# Altium project HMI_STM32_edited.PrjPcb (part 2 of 2)

## Sheet pripherals.SchDoc
size A3
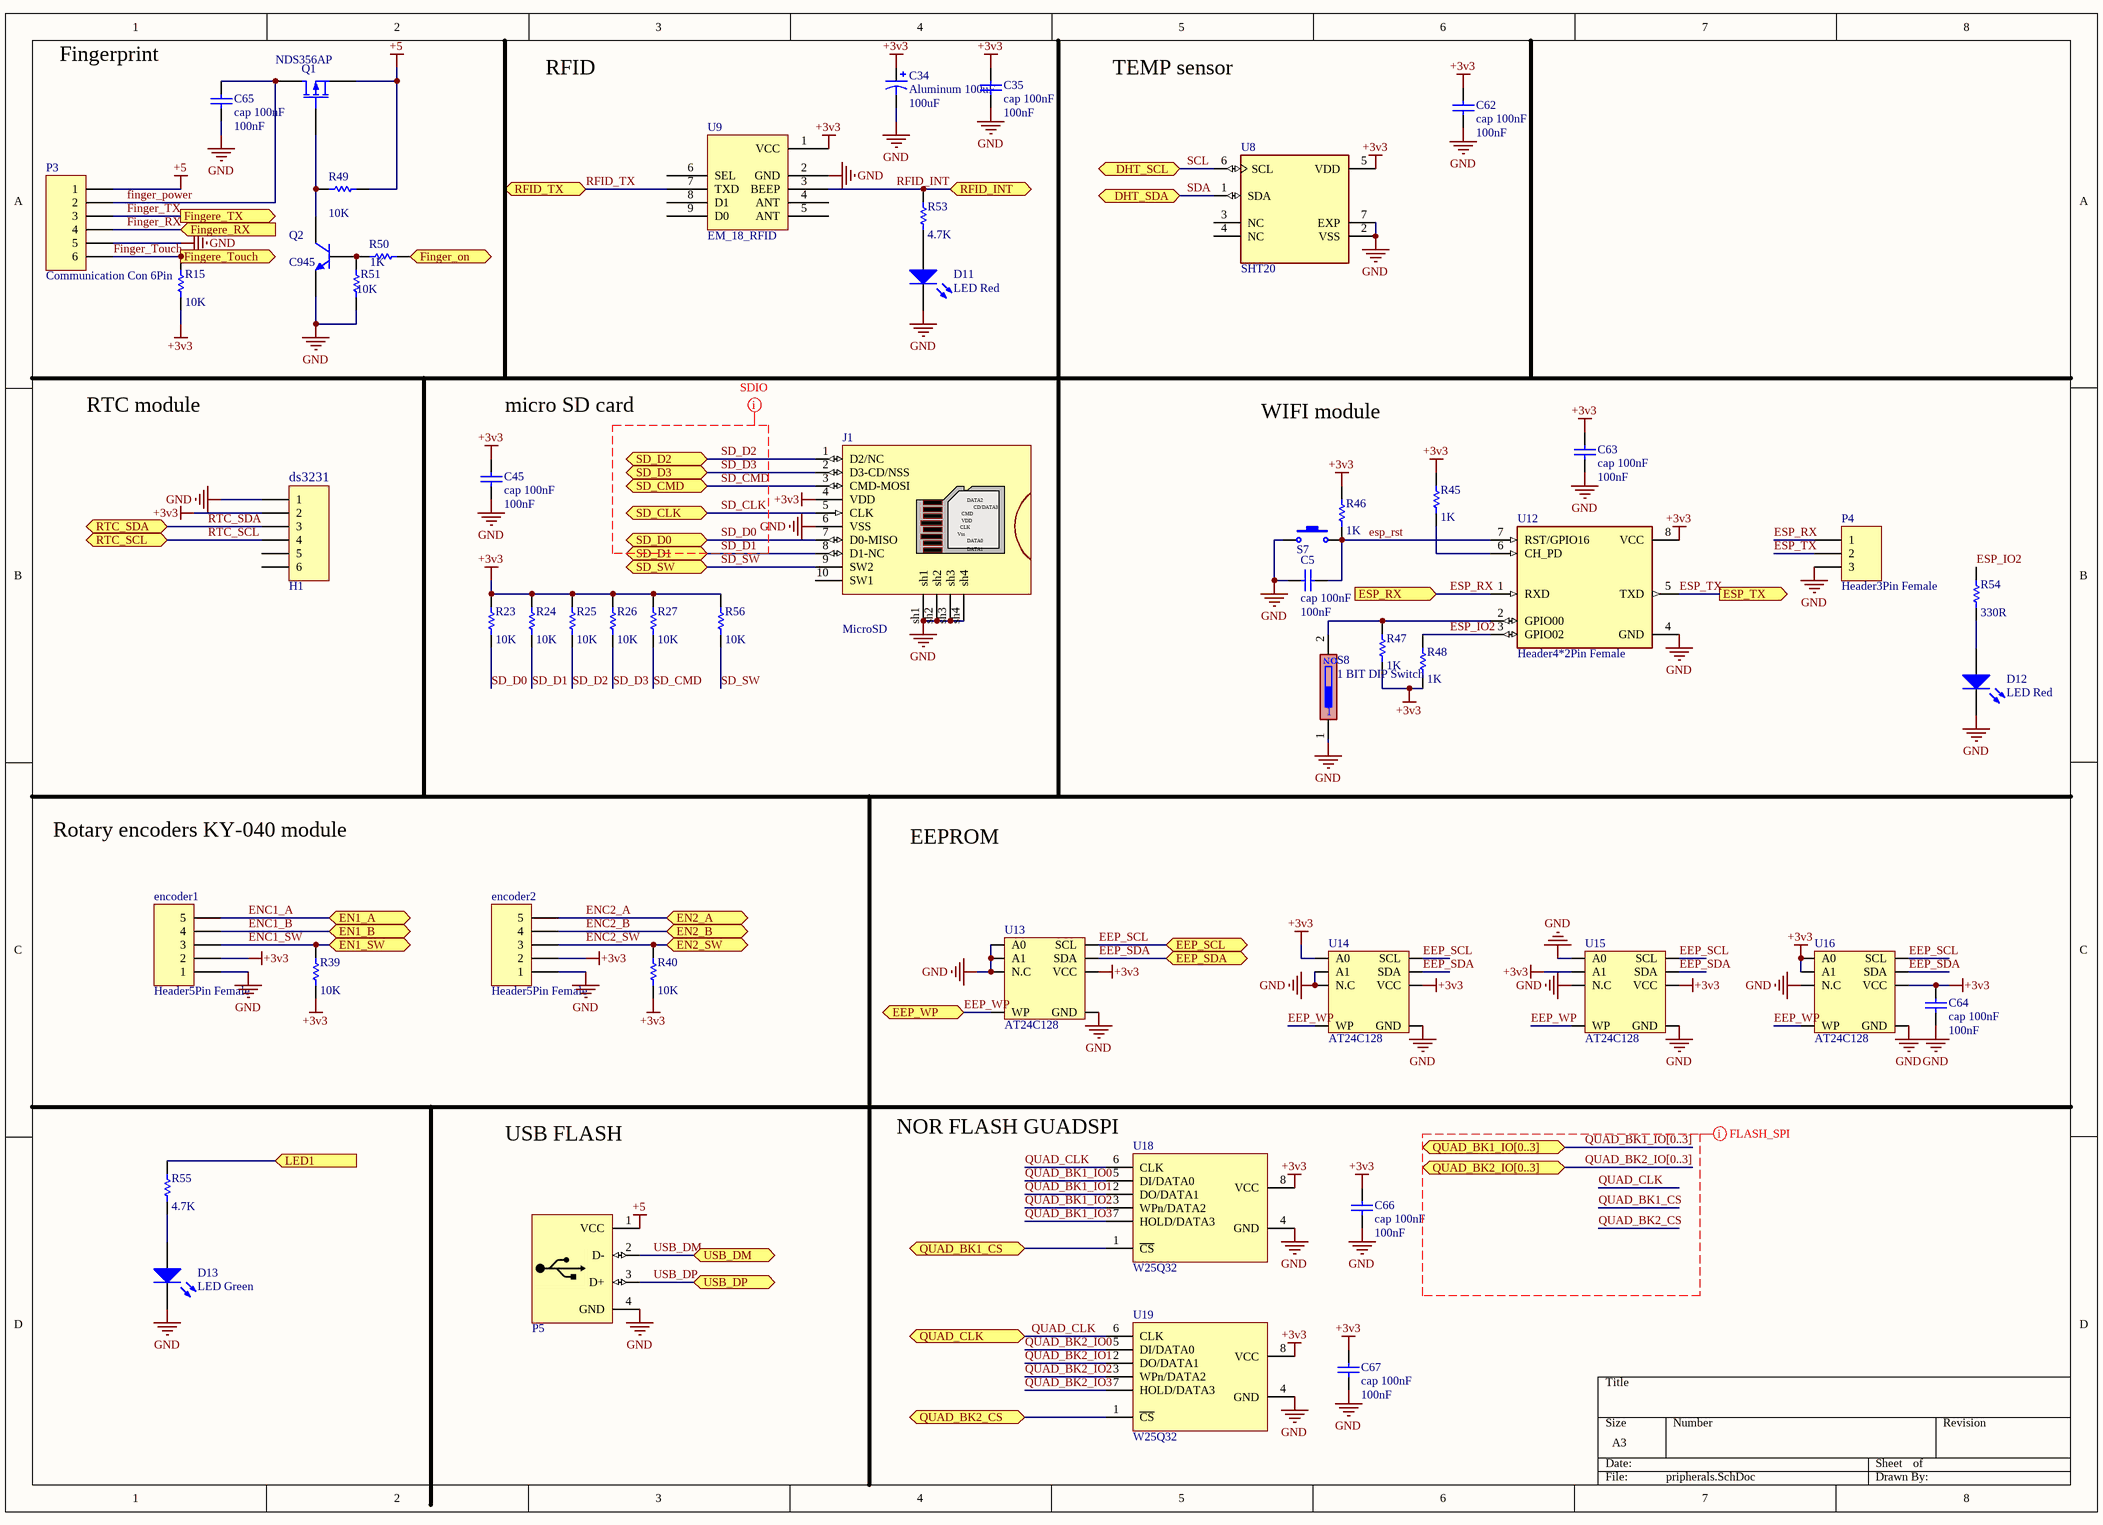
[diagram p6: pripherals.SchDoc]

### Parts
C5  cap 100nF  value 100nF  [Cap 805]
C34  Aluminum 100uF  value 100uF  [Cap SMD 100UF 35~50v]
C35  cap 100nF  value 100nF  [Cap 805]
C45  cap 100nF  value 100nF  [Cap 805]
C62  cap 100nF  value 100nF  [Cap 805]
C63  cap 100nF  value 100nF  [Cap 805]
C64  cap 100nF  value 100nF  [Cap 805]
C65  cap 100nF  value 100nF  [Cap 805]
C66  cap 100nF  value 100nF  [Cap 805]
C67  cap 100nF  value 100nF  [Cap 805]
D11  LED Red  [0805-LED]
D12  LED Red  [0805-LED]
D13  LED Green  [0805-LED]
encoder1  Header5Pin Female  [ky-040-encoder]
encoder2  Header5Pin Female  [ky-040-encoder]
H1  Header6Pin Female Right  [ds3231]  (value not drawn)
J1  MicroSD  [SD_card]
P3  Communication Con 6Pin  [HDR1X6]
P4  Header3Pin Female  [HDR1X3]
P5  USB Connector A Type Femal  [USB2.5-2H4C]  (value not drawn)
Q1  NDS356AP  [SOT23_N]
Q2  C945  [SOT23_N]
R15  value 10K  [RES 0805 (2012X06L)]  (hidden comment: Res 10K)
R23  value 10K  [RES 0805 (2012X06L)]  (hidden comment: Res 10K)
R24  value 10K  [RES 0805 (2012X06L)]  (hidden comment: Res 10K)
R25  value 10K  [RES 0805 (2012X06L)]  (hidden comment: Res 10K)
R26  value 10K  [RES 0805 (2012X06L)]  (hidden comment: Res 10K)
R27  value 10K  [RES 0805 (2012X06L)]  (hidden comment: Res 10K)
R39  value 10K  [RES 0805 (2012X06L)]  (hidden comment: Res 10K)
R40  value 10K  [RES 0805 (2012X06L)]  (hidden comment: Res 10K)
R45  value 1K  [RES 0805 (2012X06L)]  (hidden comment: Res 1K)
R46  value 1K  [RES 0805 (2012X06L)]  (hidden comment: Res 1K)
R47  value 1K  [RES 0805 (2012X06L)]  (hidden comment: Res 1K)
R48  value 1K  [RES 0805 (2012X06L)]  (hidden comment: Res 1K)
R49  value 10K  [RES 0805 (2012X06L)]  (hidden comment: Res 10K)
R50  value 1K  [RES 0805 (2012X06L)]  (hidden comment: Res 1K)
R51  value 10K  [RES 0805 (2012X06L)]  (hidden comment: Res 10K)
R53  value 4.7K  [RES 0805 (2012X06L)]  (hidden comment: Res 4.7K)
R54  value 330R  [RES 0805 (2012X06L)]  (hidden comment: Res 330R)
R55  value 4.7K  [RES 0805 (2012X06L)]  (hidden comment: Res 4.7K)
R56  value 10K  [RES 0805 (2012X06L)]  (hidden comment: Res 10K)
S7  Switch PB  [Switch - Push to On]  (value not drawn)
S8  1 BIT DIP Switch  [DIP Switch x1]
U8  SHT20  [XDCR_SHT20]
U9  EM_18_RFID  [EM-18]
U12  Header4*2Pin Female  [ESP8266-01/ESP-01]
U13  AT24C128  [SOIC-8]
U14  AT24C128  [SOIC-8]
U15  AT24C128  [SOIC-8]
U16  AT24C128  [SOIC-8]
U18  W25Q32  [WSON-8x6]
U19  W25Q32  [WSON-8x6]

### Ports
DHT_SCL (bidir), DHT_SDA (bidir), EEP_SCL (bidir), EEP_SDA (bidir), EEP_WP (bidir), EN1_A (bidir), EN1_B (bidir), EN1_SW (bidir), EN2_A (bidir), EN2_B (bidir), EN2_SW (bidir), ESP_RX (in), ESP_TX (out), Finger_on (bidir), Fingere_RX (in), Fingere_Touch (out), Fingere_TX (out), LED1 (in), QUAD_BK1_CS (bidir), QUAD_BK1_IO[0..3] (bidir), QUAD_BK2_CS (bidir), QUAD_BK2_IO[0..3] (bidir), QUAD_CLK (bidir), RFID_INT (bidir), RFID_TX (bidir), RTC_SCL (bidir), RTC_SDA (bidir), SD_CLK (bidir), SD_CMD (bidir), SD_D0 (bidir), SD_D1 (bidir), SD_D2 (bidir), SD_D3 (bidir), SD_SW (bidir), USB_DM (bidir), USB_DP (bidir)

### Nets
+3v3: C34.1 C35.2 C45.2 C62.2 C63.2 C64.2 C66.2 C67.2 encoder1.2 encoder2.2 H1.2 J1.4(VDD) R15.1 R23.2 R24.2 R25.2 R26.2 R27.2 R39.1 R40.1 R45.1 R46.1 R47.2 R48.2 R56.2 U8.5(VDD) U9.1(VCC) U12.8(VCC) U13.8(VCC) U14.1(A0) U14.8(VCC) U15.2(A1) U15.8(VCC) U16.1(A0) U16.2(A1) U16.8(VCC) U18.8(VCC) U19.8(VCC)
+5: P3.1 P5.1(VCC) Q1.3(S) R49.1
GND: C5.2 C34.2 C35.1 C45.1 C62.1 C63.1 C64.1 C65.1 C66.1 C67.1 D11.2(K) D12.2(K) D13.2(K) encoder1.1 encoder2.1 H1.1 J1.6(VSS) J1.sh1 J1.sh2 J1.sh3 J1.sh4 P3.5 P4.3 P5.4(GND) Q2.2(E) R51.1 S7.1 S8.1 U8.2(VSS) U8.7(EXP) U9.2(GND) U12.4(GND) U13.1(A0) U13.2(A1) U13.3(N.C) U13.4(GND) U14.2(A1) U14.3(N.C) U14.4(GND) U15.1(A0) U15.3(N.C) U15.4(GND) U16.3(N.C) U16.4(GND) U18.4(GND) U19.4(GND)
EEP_SCL: H1.4 U8.6(SCL) U13.6(SCL) U14.6(SCL) U15.6(SCL) U16.6(SCL) ; port DHT_SCL, port RTC_SCL, port EEP_SCL  [also labelled RTC_SCL, SCL]
EEP_SDA: H1.3 U8.1(SDA) U13.5(SDA) U14.5(SDA) U15.5(SDA) U16.5(SDA) ; port DHT_SDA, port RTC_SDA, port EEP_SDA  [also labelled RTC_SDA, SDA]
EEP_WP: U13.7(WP) U14.7(WP) U15.7(WP) U16.7(WP) ; port EEP_WP
ENC1_A: encoder1.5 ; port EN1_A  [project net EN1_A]
ENC1_B: encoder1.4 ; port EN1_B  [project net EN1_B]
ENC1_SW: encoder1.3 R39.2 ; port EN1_SW  [project net EN1_SW]
ENC2_A: encoder2.5 ; port EN2_A  [project net EN2_A]
ENC2_B: encoder2.4 ; port EN2_B  [project net EN2_B]
ENC2_SW: encoder2.3 R40.2 ; port EN2_SW  [project net EN2_SW]
ESP_IO2: R48.1 R54.2 U12.3(GPIO02)
esp_rst: C5.1 R46.2 S7.2 U12.7(RST/GPIO16)
ESP_RX: P4.1 U12.1(RXD) ; port ESP_RX
ESP_TX: P4.2 U12.5(TXD) ; port ESP_TX
Finger_on: R50.1 ; port Finger_on
finger_power: C65.2 P3.2 Q1.1(D)
Finger_RX: P3.4 ; port Fingere_RX
Finger_Touch: P3.6 R15.2 ; port Fingere_Touch
Finger_TX: P3.3 ; port Fingere_TX
LED1: R55.2 ; port LED1
QUAD_BK1_CS: U18.1(~{CS}) ; port QUAD_BK1_CS
QUAD_BK1_IO0: U18.5(DI/DATA0)
QUAD_BK1_IO1: U18.2(DO/DATA1)
QUAD_BK1_IO2: U18.3(WPn/DATA2)
QUAD_BK1_IO3: U18.7(HOLD/DATA3)
QUAD_BK2_CS: U19.1(~{CS}) ; port QUAD_BK2_CS
QUAD_BK2_IO0: U19.5(DI/DATA0)
QUAD_BK2_IO1: U19.2(DO/DATA1)
QUAD_BK2_IO2: U19.3(WPn/DATA2)
QUAD_BK2_IO3: U19.7(HOLD/DATA3)
QUAD_CLK: U18.6(CLK) U19.6(CLK) ; port QUAD_CLK
RFID_INT: R53.2 U9.3(BEEP) ; port RFID_INT
RFID_TX: U9.7(TXD) ; port RFID_TX
SD_CLK: J1.5(CLK) ; port SD_CLK
SD_CMD: J1.3(CMD-MOSI) R27.1 ; port SD_CMD
SD_D0: J1.7(D0-MISO) R23.1 ; port SD_D0
SD_D1: J1.8(D1-NC) R24.1 ; port SD_D1
SD_D2: J1.1(D2/NC) R25.1 ; port SD_D2
SD_D3: J1.2(D3-CD/NSS) R26.1 ; port SD_D3
SD_SW: J1.9(SW2) R56.1 ; port SD_SW
USB_DM: P5.2(D-) ; port USB_DM
USB_DP: P5.3(D+) ; port USB_DP
NetD11_1: D11.1(A) R53.1
NetD12_1: D12.1(A) R54.1
NetD13_1: D13.1(A) R55.1
NetQ1_2: Q1.2(G) Q2.3(C) R49.2
NetQ2_1: Q2.1(B) R50.2 R51.2
NetR45_2: R45.2 U12.6(CH_PD)
NetR47_1: R47.1 S8.2 U12.2(GPIO00)

Not connected (* = marked no-connect by the designer): H1 5 6; J1 10(SW1); U8 3(NC) 4(NC); U9 4(ANT) 5(ANT) 6(SEL) 8(D1) 9(D0)

### Buses and harness runs
bus QUAD_BK1_IO[0..3] = port QUAD_BK1_IO[0..3]
bus QUAD_BK2_IO[0..3] = port QUAD_BK2_IO[0..3]

### Layout directives
net class SDIO: SD_CLK, SD_CMD, SD_D0, SD_D1, SD_D2, SD_D3
net class FLASH_SPI: QUAD_BK1_CS, QUAD_BK1_IO[0..3], QUAD_BK2_CS, QUAD_BK2_IO[0..3], QUAD_CLK

### Notes on the sheet
- (near C65) Fingerprint
- RFID
- TEMP sensor
- RTC module
- micro SD card
- WIFI module
- (near H1) ds3231
- Rotary encoders KY-040 module
- EEPROM
- NOR FLASH GUADSPI
- USB FLASH
- (in symbol DIP Switch 1) ON
- (in symbol MicroSD) DATA2; CD/DATA3; CMD; Vss; DATA0; DATA1

### Library data of the parts
C5 C35 C45 C62-C67 = Cap: Capacitor; Published: 8-Jun-2000; LatestRevisionDate: 17-Jul-2002; LatestRevisionNote: Re-released for DXP Platform.; PackageReference: RAD-0.3; Publisher: Altium Limited; PackageDescription: Radial Cap, Thru-Hole; 2 Leads; 0.3 in Pin Spacing
C34 = Cap Pol1: Polarized Capacitor Aluminum; Published: 8-Jun-2000; LatestRevisionDate: 17-Jul-2002; LatestRevisionNote: Re-released for DXP Platform.; PackageReference: RB7.6-15; Publisher: Altium Limited; PackageDescription: Polarized Capacitor (Radial); 2 Leads
D11-D13 = LED0: LED SMD; pin to pad: 1>A 2>C; Published: 8-Jun-2000; LatestRevisionDate: 08-Jul-2005; LatestRevisionNote: Mech Layer 1 removed.; PackageReference: LED-0; Publisher: Altium Limited; PackageDescription: LED; 2 Leads
encoder1 encoder2 = Header 5: Header, 5-Pin; LatestRevisionDate: 17-Jul-2002; LatestRevisionNote: Re-released for DXP Platform.; Publisher: Altium Limited
H1 = H-1x6: RTC module
J1 = MicroSD: Created by:: altium designer (M.Hariri); VALUE: MicroSD
P3 = Header 6: Finger print module; LatestRevisionDate: 17-Jul-2002; LatestRevisionNote: Re-released for DXP Platform.; Publisher: Altium Limited
P4 = Header 3: Header, 3-Pin; LatestRevisionDate: 17-Jul-2002; LatestRevisionNote: Re-released for DXP Platform.; Publisher: Altium Limited
P5 = USB A-Type: USB Connector-A Type Femal
Q1 = MOSFET-P: P-Channel MOSFET; pin to pad: 2>3 3>2; Published: 8-Jun-2000; LatestRevisionDate: 17-Jul-2002; LatestRevisionNote: Re-released for DXP Platform.; PackageVersion: 1995/1996; PackageReference: E3; Publisher: Altium Limited; PackageDescription: TO, Flat Index; 3 In-Line, Axial Leads; Body Dia. 4.6mm; Lead Dia. 0.5 mm (max)
Q2 = C945: NPN Silicon Epitaxial Planar Transistor; Published: 2017-2-8; LatestRevisionDate: 2017; LatestRevisionNote: IPC-7351 Footprint Added.; DatasheetVersion: 2017; PackageVersion: 2017-2-8; PackageReference: SOT23; Publisher: Abbas Basereh; PackageDescription: 3-Pin SOT-23 Package 0.95 mm Pitch, 2.3 mm Lead Span; ComponentLink1Description: Manufacturer Link; ComponentLink1URL: http://www.taitroncomponents.com/; ComponentLink2Description: Datasheet; ComponentLink2URL: http://www.taitroncomponents.com/
R15 R23-R27 R39 R40 R45-R51 R53-R56 = Res1: Resistor; Published: 8-Jun-2000; LatestRevisionDate: 17-Jul-2002; LatestRevisionNote: Re-released for DXP Platform.; PackageReference: AXIAL-0.3; Publisher: Altium Limited; PackageDescription: Axial Device, Thru-Hole; 2 Leads; 0.3 in Pin Spacing
S7 = Switch PB: Push Button Switch
S8 = DIP Switch 1: Program
U8 = SHT20: SENSOR HUMID/TEMP 3V I2C 3% SMD; MF: Sensirion AG; MP: SHT20; Package: DFN-6 Sensirion; Availability: Unavailable; Price: None; SnapEDA_Link: https://www.snapeda.com/parts/SHT20/Sensirion%20AG/view-part/53498/?ref=snap; Value: *
U9 = EM_18: RFID reader
U12 = ESP8266-01/ESP-01: ESP-01 wifi module; MF: AI-Thinker; Package: None; Availability: Unavailable; MP: ESP8266-01/ESP-01; Value: *; SnapEDA_Link: https://www.snapeda.com/parts/ESP8266-01/ESP-01/AI-Thinker/view-part/106413/?ref=snap; Price: None
U13-U16 = AT24C128: EEPROM
U18 U19 = W25Q32: NOR flash

## Sheet pripherals2.SchDoc
size A4
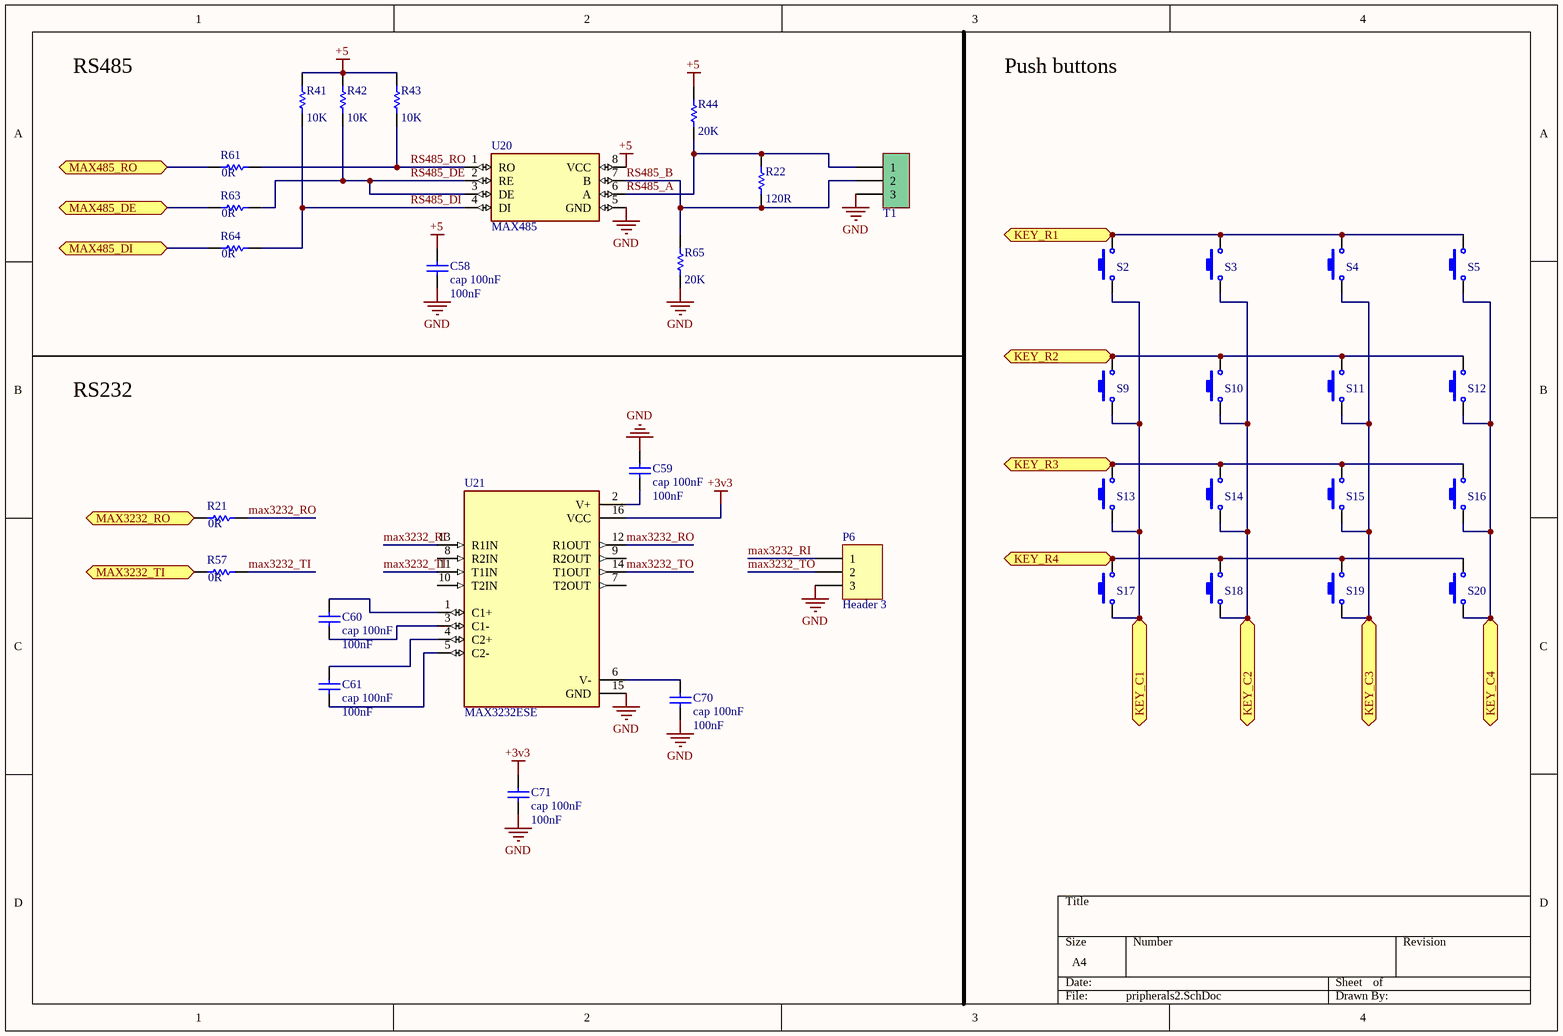
[diagram p7: pripherals2.SchDoc]

### Parts
C58  cap 100nF  value 100nF  [Cap 805]
C59  cap 100nF  value 100nF  [Cap 805]
C60  cap 100nF  value 100nF  [Cap 805]
C61  cap 100nF  value 100nF  [Cap 805]
C70  cap 100nF  value 100nF  [Cap 805]
C71  cap 100nF  value 100nF  [Cap 805]
P6  Header 3  [HDR1X3]
R21  value 0R  [RES 0805 (2012X06L)]  (hidden comment: Res 0R)
R22  value 120R  [RES 0805 (2012X06L)]  (hidden comment: Res 120R)
R41  value 10K  [RES 0805 (2012X06L)]  (hidden comment: Res 10K)
R42  value 10K  [RES 0805 (2012X06L)]  (hidden comment: Res 10K)
R43  value 10K  [RES 0805 (2012X06L)]  (hidden comment: Res 10K)
R44  value 20K  [RES 0805 (2012X06L)]  (hidden comment: Res 20K)
R57  value 0R  [RES 0805 (2012X06L)]  (hidden comment: Res 0R)
R61  value 0R  [RES 0805 (2012X06L)]  (hidden comment: Res 0R)
R63  value 0R  [RES 0805 (2012X06L)]  (hidden comment: Res 0R)
R64  value 0R  [RES 0805 (2012X06L)]  (hidden comment: Res 0R)
R65  value 20K  [RES 0805 (2012X06L)]  (hidden comment: Res 20K)
S2  Switch PB 12*12mm  [tact-12mm]  (value not drawn)
S3  Switch PB 12*12mm  [tact-12mm]  (value not drawn)
S4  Switch PB 12*12mm  [tact-12mm]  (value not drawn)
S5  Switch PB 12*12mm  [tact-12mm]  (value not drawn)
S9  Switch PB 12*12mm  [tact-12mm]  (value not drawn)
S10  Switch PB 12*12mm  [tact-12mm]  (value not drawn)
S11  Switch PB 12*12mm  [tact-12mm]  (value not drawn)
S12  Switch PB 12*12mm  [tact-12mm]  (value not drawn)
S13  Switch PB 12*12mm  [tact-12mm]  (value not drawn)
S14  Switch PB 12*12mm  [tact-12mm]  (value not drawn)
S15  Switch PB 12*12mm  [tact-12mm]  (value not drawn)
S16  Switch PB 12*12mm  [tact-12mm]  (value not drawn)
S17  Switch PB 12*12mm  [tact-12mm]  (value not drawn)
S18  Switch PB 12*12mm  [tact-12mm]  (value not drawn)
S19  Switch PB 12*12mm  [tact-12mm]  (value not drawn)
S20  Switch PB 12*12mm  [tact-12mm]  (value not drawn)
T1  Phoenix terminal 3  [phoenix terminal 3]  (value not drawn)
U20  MAX485  [SOIC8-Narrow]
U21  MAX3232ESE  [SOIC16_M]

### Ports
KEY_C1 (bidir), KEY_C2 (bidir), KEY_C3 (bidir), KEY_C4 (bidir), KEY_R1 (bidir), KEY_R2 (bidir), KEY_R3 (bidir), KEY_R4 (bidir), MAX485_DE (bidir), MAX485_DI (bidir), MAX485_RO (bidir), MAX3232_RO (bidir), MAX3232_TI (bidir)

### Nets
+3v3: C71.1 U21.16(VCC)
+5: C58.1 R41.1 R42.1 R43.1 R44.1 U20.8(VCC)
GND: C58.2 C59.1 C70.2 C71.2 P6.3 R65.2 T1.3 U20.5(GND) U21.15(GND)
KEY_C1: S2.1 S9.1 S13.1 S17.1 ; port KEY_C1
KEY_C2: S3.1 S10.1 S14.1 S18.1 ; port KEY_C2
KEY_C3: S4.1 S11.1 S15.1 S19.1 ; port KEY_C3
KEY_C4: S5.1 S12.1 S16.1 S20.1 ; port KEY_C4
KEY_R1: S2.2 S3.2 S4.2 S5.2 ; port KEY_R1
KEY_R2: S9.2 S10.2 S11.2 S12.2 ; port KEY_R2
KEY_R3: S13.2 S14.2 S15.2 S16.2 ; port KEY_R3
KEY_R4: S17.2 S18.2 S19.2 S20.2 ; port KEY_R4
max3232_RI: P6.1 U21.13(R1IN)
max3232_RO: R21.2 U21.12(R1OUT)
max3232_TI: R57.2 U21.11(T1IN)
max3232_TO: P6.2 U21.14(T1OUT)
MAX_DE: R63.1 ; port MAX485_DE
MAX_DI: R57.1 R64.1 ; port MAX485_DI, port MAX3232_TI
MAX_RO: R21.1 R61.1 ; port MAX485_RO, port MAX3232_RO
RS485_A: R22.1 R44.2 T1.1 U20.6(A)
RS485_B: R22.2 R65.1 T1.2 U20.7(B)
RS485_DE: R42.2 R63.2 U20.2(RE) U20.3(DE)
RS485_DI: R41.2 R64.2 U20.4(DI)
RS485_RO: R43.2 R61.2 U20.1(RO)
NetC59_2: C59.2 U21.2(V+)
NetC60_1: C60.1 U21.1(C1+)
NetC60_2: C60.2 U21.3(C1-)
NetC61_1: C61.1 U21.4(C2+)
NetC61_2: C61.2 U21.5(C2-)
NetC70_1: C70.1 U21.6(V-)

Not connected (* = marked no-connect by the designer): U21 7(T2OUT) 8(R2IN) 9(R2OUT) 10(T2IN)

### Notes on the sheet
- RS485
- Push buttons
- RS232

### Library data of the parts
C58-C61 C70 C71 = Cap: Capacitor; Published: 8-Jun-2000; LatestRevisionDate: 17-Jul-2002; LatestRevisionNote: Re-released for DXP Platform.; PackageReference: RAD-0.3; Publisher: Altium Limited; PackageDescription: Radial Cap, Thru-Hole; 2 Leads; 0.3 in Pin Spacing
P6 = Header 3: Header, 3-Pin; LatestRevisionDate: 17-Jul-2002; LatestRevisionNote: Re-released for DXP Platform.; Publisher: Altium Limited
R21 R22 R41-R44 R57 R61 R63-R65 = Res1: Resistor; Published: 8-Jun-2000; LatestRevisionDate: 17-Jul-2002; LatestRevisionNote: Re-released for DXP Platform.; PackageReference: AXIAL-0.3; Publisher: Altium Limited; PackageDescription: Axial Device, Thru-Hole; 2 Leads; 0.3 in Pin Spacing
S2-S5 S9-S20 = Switch PB: Push Button Switch
T1 = Phoenix terminal 3: Terminal 3 Pin; Designer: Seyed Mohsen Ghasemain; E-mail: picpars@gmail.com; ComponentLinkURL: www.picpars.com
U20 = MAX485: 1/1 Transceiver Half RS422, RS485 8-SOIC; MF: Maxim Integrated; SnapEDA_Link: https://www.snapeda.com/parts/MAX485/Maxim%20Integrated/view-part/493689/?ref=snap; Package: SOIC-8 Maxim Integrated; MP: MAX485; Value: *; Digi-Key_Part_Number: MAX485CSA+TCT-ND; Digi-Key_Purchase_URL: https://www.digikey.com/product-detail/en/maxim-integrated/MAX485CSA-T/MAX485CSA-TCT-ND/3894816?utm_source=snapeda&utm_medium=aggregator&utm_campaign=symbol
U21 = MAX3232ESE: 2/2 Transceiver Full RS232 16-SO; MF: Maxim Integrated; MP: MAX3232ESE; SnapEDA_Link: https://www.snapeda.com/parts/MAX3232ESE/Maxim%20Integrated/view-part/991442/?ref=snap; Price: None; Package: None; Availability: Unavailable; Value: *

## Nets that join several sheets
4v2: GSM (7 pins), power (FB1.2)
+3v3: micro (36 pins), power (C2.2 R1.2 U1.2 U1.4), pripherals (38 pins), pripherals2 (C71.1 U21.16)
+3v3_lcd: lcd (10 pins), power (C4.2 R2.2 U2.2 U2.4)
+3v3_ram: SDRAM (20 pins), power (C7.2 R5.2 U3.2 U3.4)
+5: lcd (L6.2), power (13 pins), pripherals (P3.1 P5.1 Q1.3 R49.1), pripherals2 (6 pins)
GND: micro (39 pins), SDRAM (20 pins), GSM (29 pins), lcd (44 pins), power (23 pins), pripherals (46 pins), pripherals2 (9 pins)
EEP_SCL: micro (R13.2 U6.164), pripherals (6 pins)
EEP_SDA: micro (R14.2 U6.165), pripherals (6 pins)
EEP_WP: micro (U6.163), pripherals (U13.7 U14.7 U15.7 U16.7)
EN1_A: micro (U6.57), pripherals (encoder1.5)
EN1_B: micro (U6.84), pripherals (encoder1.4)
EN1_SW: micro (U6.85), pripherals (encoder1.3 R39.2)
EN2_A: micro (U6.55), pripherals (encoder2.5)
EN2_B: micro (U6.46), pripherals (encoder2.4)
EN2_SW: micro (U6.45), pripherals (encoder2.3 R40.2)
ESP_RX: micro (U6.120), pripherals (P4.1 U12.1)
ESP_TX: micro (U6.119), pripherals (P4.2 U12.5)
Finger_on: micro (U6.7), pripherals (R50.1)
Finger_RX: micro (U6.42), pripherals (P3.4)
Finger_Touch: micro (U6.8), pripherals (P3.6 R15.2)
Finger_TX: micro (U6.47), pripherals (P3.3)
FMC_A0: micro (U6.16), SDRAM (U4.23)
FMC_A1: micro (U6.17), SDRAM (U4.24)
FMC_A2: micro (U6.18), SDRAM (U4.25)
FMC_A3: micro (U6.19), SDRAM (U4.26)
FMC_A4: micro (U6.20), SDRAM (U4.29)
FMC_A5: micro (U6.21), SDRAM (U4.30)
FMC_A6: micro (U6.60), SDRAM (U4.31)
FMC_A7: micro (U6.63), SDRAM (U4.32)
FMC_A8: micro (U6.64), SDRAM (U4.33)
FMC_A9: micro (U6.65), SDRAM (U4.34)
FMC_A10: micro (U6.66), SDRAM (U4.22)
FMC_A11: micro (U6.67), SDRAM (U4.35)
FMC_A12: micro (U6.106), SDRAM (U4.36)
FMC_ALE: micro (U6.100), SDRAM (U7.17)
FMC_BA0: micro (U6.108), SDRAM (U4.20)
FMC_BA1: micro (U6.109), SDRAM (U4.21)
FMC_CLE: micro (U6.99), SDRAM (U7.16)
FMC_D0: micro (U6.104), SDRAM (U4.2 U7.29)
FMC_D1: micro (U6.105), SDRAM (U4.4 U7.30)
FMC_D2: micro (U6.142), SDRAM (U4.5 U7.31)
FMC_D3: micro (U6.143), SDRAM (U4.7 U7.32)
FMC_D4: micro (U6.68), SDRAM (U4.8 U7.41)
FMC_D5: micro (U6.69), SDRAM (U4.10 U7.42)
FMC_D6: micro (U6.70), SDRAM (U4.11 U7.43)
FMC_D7: micro (U6.73), SDRAM (U4.13 U7.44)
FMC_D8: micro (U6.74), SDRAM (U4.42)
FMC_D9: micro (U6.75), SDRAM (U4.44)
FMC_D10: micro (U6.76), SDRAM (U4.45)
FMC_D11: micro (U6.77), SDRAM (U4.47)
FMC_D12: micro (U6.78), SDRAM (U4.48)
FMC_D13: micro (U6.96), SDRAM (U4.50)
FMC_D14: micro (U6.97), SDRAM (U4.51)
FMC_D15: micro (U6.98), SDRAM (U4.53)
FMC_NCE: micro (U6.117), SDRAM (R12.2 U7.9)
FMC_NOE: micro (U6.146), SDRAM (U7.8)
FMC_NWAIT: micro (U6.115), SDRAM (R11.1 U7.7)
FMC_NWE: micro (U6.147), SDRAM (U7.18)
FMC_SDCKE0: micro (U6.35), SDRAM (U4.37)
FMC_SDCLK: micro (U6.112), SDRAM (U4.38)
FMC_SDNCAS: micro (U6.160), SDRAM (U4.17)
FMC_SDNE0: micro (U6.34), SDRAM (U4.19)
FMC_SDNRAS: micro (U6.59), SDRAM (U4.18)
FMC_SDNWE: micro (U6.32), SDRAM (U4.16)
GSM_NET_light: micro (U6.107), GSM (R16.1 SIM1.41)
GSM_PWRKEY: micro (U6.116), GSM (SIM1.39)
GSM_RI_INT: micro (U6.153), GSM (SIM1.7)
GSM_RXD: micro (U6.93), GSM (SIM1.2)
GSM_status: micro (U6.101), GSM (R17.1 SIM1.42)
GSM_TXD: micro (U6.92), GSM (SIM1.1)
KEY_C1: micro (U6.4), pripherals2 (S2.1 S9.1 S13.1 S17.1)
KEY_C2: micro (U6.3), pripherals2 (S3.1 S10.1 S14.1 S18.1)
KEY_C3: micro (U6.1), pripherals2 (S4.1 S11.1 S15.1 S19.1)
KEY_C4: micro (U6.2), pripherals2 (S5.1 S12.1 S16.1 S20.1)
KEY_R1: micro (U6.144), pripherals2 (S2.2 S3.2 S4.2 S5.2)
KEY_R2: micro (U6.168), pripherals2 (S9.2 S10.2 S11.2 S12.2)
KEY_R3: micro (U6.167), pripherals2 (S13.2 S14.2 S15.2 S16.2)
KEY_R4: micro (U6.145), pripherals2 (S17.2 S18.2 S19.2 S20.2)
LCD_B3: micro (U6.154), lcd (lcd1.24 lcd2.16)
LCD_B4: micro (U6.173), lcd (lcd1.25 lcd2.15)
LCD_B5: micro (U6.174), lcd (lcd1.26 lcd2.14)
LCD_B6: micro (U6.175), lcd (lcd1.27 lcd2.13)
LCD_B7: micro (U6.176), lcd (lcd1.28 lcd2.12)
LCD_BKL: micro (U6.56), lcd (R33.2 U10.4)
LCD_DCLK: micro (U6.111), lcd (lcd1.30 lcd2.37)
LCD_DE: micro (U6.28), lcd (lcd1.34 lcd2.9)
LCD_G2: micro (U6.128), lcd (lcd1.15 lcd2.25)
LCD_G3: micro (U6.129), lcd (lcd1.16 lcd2.24)
LCD_G4: micro (U6.130), lcd (lcd1.17 lcd2.23)
LCD_G5: micro (U6.131), lcd (lcd1.18 lcd2.22)
LCD_G6: micro (U6.132), lcd (lcd1.19 lcd2.21)
LCD_G7: micro (U6.133), lcd (lcd1.20 lcd2.20)
LCD_HS: micro (U6.12), lcd (lcd1.32 lcd2.11)
LCD_R3: micro (U6.86), lcd (lcd1.8 lcd2.32)
LCD_R4: micro (U6.87), lcd (lcd1.9 lcd2.31)
LCD_R5: micro (U6.88), lcd (lcd1.10 lcd2.30)
LCD_R6: micro (U6.89), lcd (lcd1.11 lcd2.29)
LCD_R7: micro (U6.110), lcd (lcd1.12 lcd2.28)
LCD_VS: micro (U6.11), lcd (lcd1.33 lcd2.10)
LED1: micro (U6.13), pripherals (R55.2)
MAX_DE: micro (U6.5), pripherals2 (R63.1)
MAX_DI: micro (U6.40), pripherals2 (R57.1 R64.1)
MAX_RO: micro (U6.41), pripherals2 (R21.1 R61.1)
NetU4_15: micro (U6.169), SDRAM (U4.15)
NetU4_39: micro (U6.170), SDRAM (U4.39)
QUAD_BK1_CS: micro (U6.79), pripherals (U18.1)
QUAD_BK1_IO0: micro (U6.26), pripherals (U18.5)
QUAD_BK1_IO1: micro (U6.27), pripherals (U18.2)
QUAD_BK1_IO2: micro (U6.25), pripherals (U18.3)
QUAD_BK1_IO3: micro (U6.24), pripherals (U18.7)
QUAD_BK2_CS: micro (U6.140), pripherals (U19.1)
QUAD_BK2_IO0: micro (U6.43), pripherals (U19.5)
QUAD_BK2_IO1: micro (U6.44), pripherals (U19.2)
QUAD_BK2_IO2: micro (U6.152), pripherals (U19.3)
QUAD_BK2_IO3: micro (U6.157), pripherals (U19.7)
QUAD_CLK: micro (U6.58), pripherals (U18.6 U19.6)
RFID_INT: micro (U6.83), pripherals (R53.2 U9.3)
RFID_TX: micro (U6.80), pripherals (U9.7)
SD_CLK: micro (U6.150), pripherals (J1.5)
SD_CMD: micro (U6.151), pripherals (J1.3 R27.1)
SD_D0: micro (U6.94), pripherals (J1.7 R23.1)
SD_D1: micro (U6.95), pripherals (J1.8 R24.1)
SD_D2: micro (U6.161), pripherals (J1.1 R25.1)
SD_D3: micro (U6.162), pripherals (J1.2 R26.1)
SD_SW: micro (U6.134), pripherals (J1.9 R56.1)
TOUCH_CS: micro (U6.50), lcd (U11.15)
TOUCH_MISO: micro (U6.52), lcd (U11.12)
TOUCH_MOSI: micro (U6.53), lcd (U11.14)
TOUCH_PEN: micro (U6.54), lcd (U11.11)
TOUCH_SCK: micro (U6.51), lcd (U11.16)
USB_DM: micro (U6.122), power (p1.2), pripherals (P5.2)
USB_DP: micro (U6.123), power (p1.3), pripherals (P5.3)
USBID: micro (U6.121), power (p1.4)